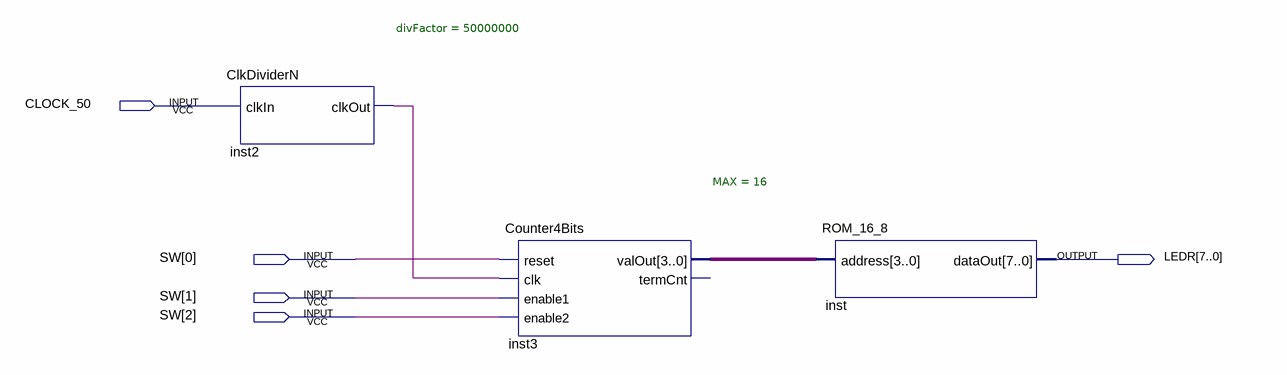
[diagram p0: schematic sheet]
// Quartus schematic ROM_Demo_Counter.bdf as structural Verilog: 3 symbols, 5 pins
module ROM_Demo_Counter (
  input  CLOCK_50,
  input  [2:0] SW,
  output [7:0] LEDR
);

  wire inst2_clkout;
  wire [3:0] inst3_valout;

  ClkDividerN #(.divFactor(50000000)) inst2 (.clkIn(CLOCK_50), .clkOut(inst2_clkout));
  Counter4Bits #(.MAX(16)) inst3 (
    .reset(SW[0]), .clk(inst2_clkout), .enable1(SW[1]), .enable2(SW[2]), .valOut(inst3_valout));  // open: termCnt
  ROM_16_8 inst (.address(inst3_valout), .dataOut(LEDR));
endmodule
